# Altium schematic sheet USB.SchDoc
size A4
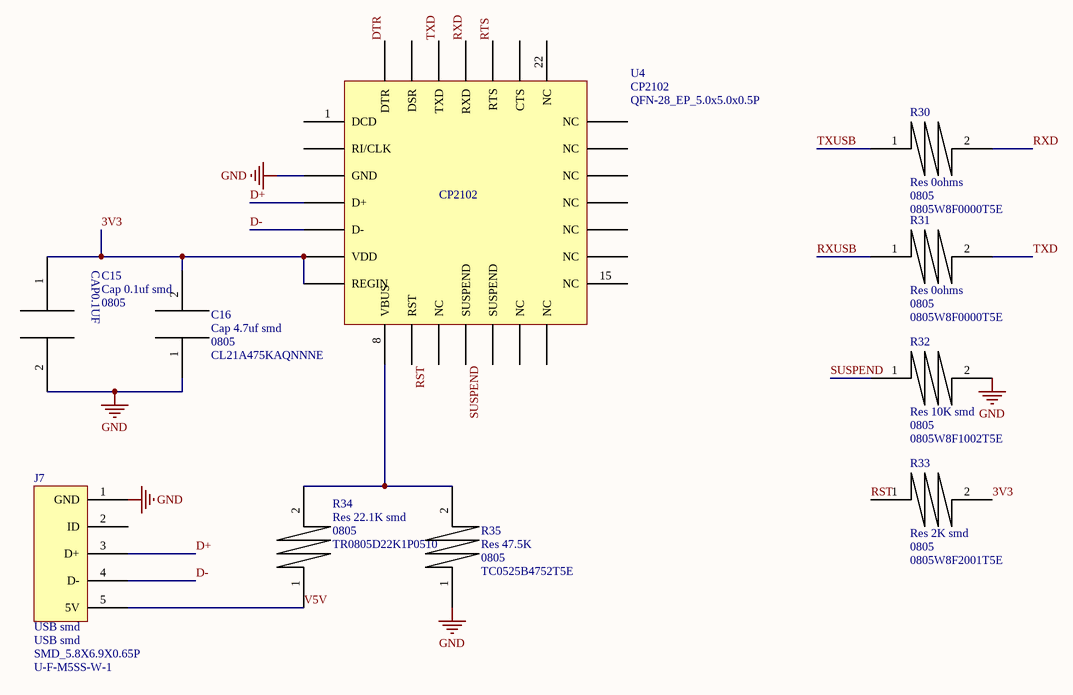
[diagram p0: USB.SchDoc]

## Parts
C15  Cap 0.1uf smd  Package: 0805  [CAP0.1UFSMD]
C16  Cap 4.7uf smd  Package: 0805  MFR.Part #: CL21A475KAQNNNE  [CAP4.7UFSMD]
J7  USB smd  Package: SMD_5.8X6.9X0.65P  MFR.Part #: U-F-M5SS-W-1  [USB smd]
R30  Res 0ohms  Package: 0805  MFR.Part #: 0805W8F0000T5E  [RES 0 Ohms]
R31  Res 0ohms  Package: 0805  MFR.Part #: 0805W8F0000T5E  [RES 0 Ohms]
R32  Res 10K smd  Package: 0805  MFR.Part #: 0805W8F1002T5E  [RES 10K]
R33  Res 2K smd  Package: 0805  MFR.Part #: 0805W8F2001T5E  [RES 2K]
R34  Res 22.1K smd  Package: 0805  MFR.Part #: TR0805D22K1P0510  [RES 22.1K]
R35  Res 47.5K  Package: 0805  MFR.Part #: TC0525B4752T5E  [RES 47.5K]
U4  CP2102  Package: QFN-28_EP_5.0x5.0x0.5P  [CP2102]

## Nets
GND: C15.2 C16.1 J7.1(GND) R32.2 R35.1 U4.3(GND)
3V3: C15.1 C16.2 R33.2 U4.6(VDD) U4.7(REGIN)
D+: J7.3(D+) U4.4(D+)
D-: J7.4(D-) U4.5(D-)
DTR: U4.28(DTR)
RST: R33.1 U4.9(RST)
RTS: U4.24(RTS)
RXD: R30.2 U4.25(RXD)
RXUSB: R31.1
SUSPEND: R32.1 U4.11(SUSPEND)
TXD: R31.2 U4.26(TXD)
TXUSB: R30.1
V5V: J7.5(5V) R34.1
NetR34_2: R34.2 R35.2 U4.8(VBUS)

Not connected (* = marked no-connect by the designer): J7 2(ID); U4 1(DCD) 2(RI/CLK) 10(NC) 12(SUSPEND) 13(NC) 14(NC) 15(NC) 16(NC) 17(NC) 18(NC) 19(NC) 20(NC) 21(NC) 22(NC) 23(CTS) 27(DSR)

## Notes on the sheet
- (in symbol Cap 0.1uf smd) CAP0.1UF

## Library data of the parts
C15 = Cap 0.1uf smd: 0.1uf
C16 = Cap 4.7uf smd: 4.7uf
R32 = Res 10K smd: 10K
R33 = Res 2K smd: 2K
R34 = Res 22.1K smd: 22.1K
R35 = Res 47.5K: 47.5K